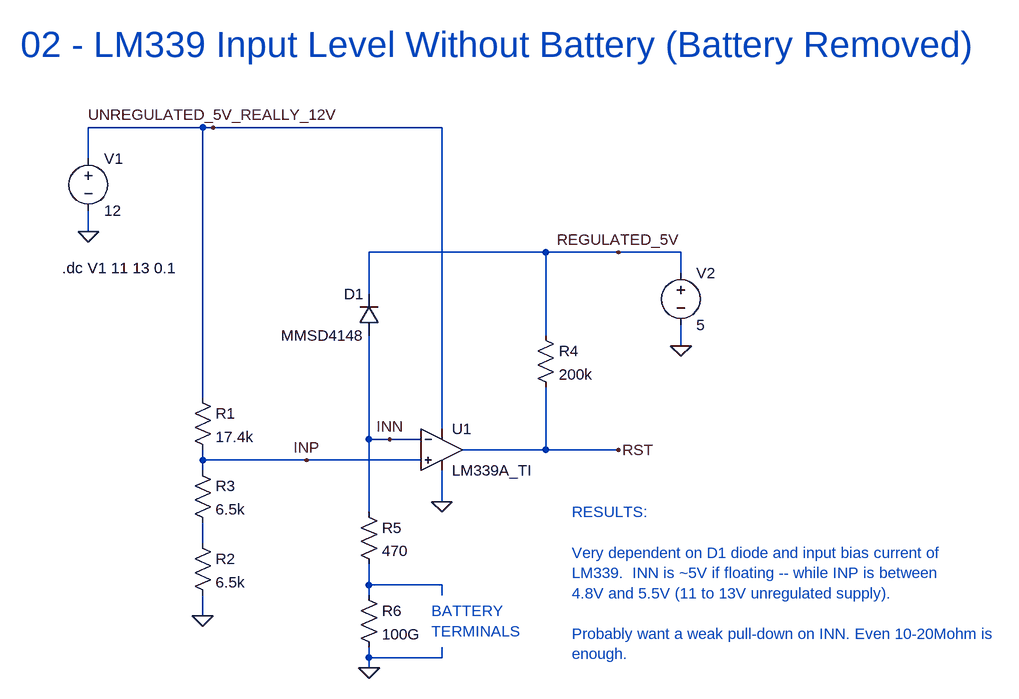
[diagram p0: schematic 02 - LM339 Input Level Without Battery.asc]
02 - LM339 Input Level Without Battery.asc, the LTspice schematic file:
Version 4.1
SHEET 1 1788 744
WIRE 80 -128 -96 -128
WIRE 96 -128 80 -128
WIRE 448 -128 96 -128
WIRE -96 -80 -96 -128
WIRE -96 32 -96 0
WIRE 608 64 336 64
WIRE 720 64 608 64
WIRE 816 64 720 64
WIRE 816 96 816 64
WIRE 336 128 336 64
WIRE 608 192 608 64
WIRE 816 208 816 176
WIRE 80 288 80 -128
WIRE 448 336 448 -128
WIRE 336 352 336 192
WIRE 368 352 336 352
WIRE 416 352 368 352
WIRE 608 368 608 272
WIRE 608 368 480 368
WIRE 720 368 608 368
WIRE 80 384 80 368
WIRE 240 384 80 384
WIRE 416 384 240 384
WIRE 80 400 80 384
WIRE 448 448 448 400
WIRE 336 464 336 352
WIRE 80 512 80 480
WIRE 336 576 336 544
WIRE 448 576 336 576
WIRE 336 592 336 576
WIRE 448 592 448 576
WIRE 80 624 80 592
WIRE 336 688 336 672
WIRE 448 688 448 672
WIRE 448 688 336 688
WIRE 336 704 336 688
FLAG 448 448 0
FLAG 720 368 RST
FLAG 80 624 0
FLAG 368 352 INN
FLAG 336 704 0
FLAG -96 32 0
FLAG 96 -128 UNREGULATED_5V_REALLY_12V
FLAG 816 208 0
FLAG 720 64 REGULATED_5V
FLAG 240 384 INP
SYMBOL ZZZ\\Comparator\\LM339A_TI 448 368 R0
SYMATTR InstName U1
SYMBOL voltage -96 -96 R0
SYMATTR InstName V1
SYMATTR Value 12
SYMBOL res 64 272 R0
SYMATTR InstName R1
SYMATTR Value 17.4k
SYMBOL res 64 496 R0
SYMATTR InstName R2
SYMATTR Value 6.5k
SYMBOL res 592 176 R0
SYMATTR InstName R4
SYMATTR Value 200k
SYMBOL voltage 816 80 R0
SYMATTR InstName V2
SYMATTR Value 5
SYMBOL diode 352 192 R180
WINDOW 0 24 64 Left 2
WINDOW 3 24 0 Left 2
SYMATTR InstName D1
SYMATTR Value MMSD4148
SYMBOL res 320 576 R0
SYMATTR InstName R6
SYMATTR Value 100G
SYMBOL res 64 384 R0
SYMATTR InstName R3
SYMATTR Value 6.5k
SYMBOL res 320 448 R0
SYMATTR InstName R5
SYMATTR Value 470
TEXT -200 -256 Left 5 ;02 - LM339 Input Level Without Battery (Battery Removed)
TEXT 432 616 Left 2 ;BATTERY\nTERMINALS
TEXT -136 88 Left 2 !.dc V1 11 13 0.1
TEXT 648 464 Left 2 ;RESULTS:\n \nVery dependent on D1 diode and input bias current of\nLM339.  INN is ~5V if floating -- while INP is between\n4.8V and 5.5V (11 to 13V unregulated supply).\n \nProbably want a weak pull-down on INN. Even 10-20Mohm is\nenough.

The netlist it stands for:
* 02 - LM339 Input Level Without Battery.asc
* U1: LM339A_TI (symbol ZZZ\Comparator\LM339A_TI not available, pins judged from their places): In+=INP In-=INN V+=UNREGULATED_5V_REALLY_12V V-=0 OUT=RST
V1 UNREGULATED_5V_REALLY_12V 0 12
R1 UNREGULATED_5V_REALLY_12V INP 17.4k
R2 N001 0 6.5k
R4 REGULATED_5V RST 200k
V2 REGULATED_5V 0 5
D1 INN REGULATED_5V MMSD4148
R6 N002 0 100G
R3 INP N001 6.5k
R5 INN N002 470
.model D D
.lib standard.dio
* 02 - LM339 Input Level Without Battery (Battery Removed)
* BATTERY
* TERMINALS
.dc V1 11 13 0.1
* RESULTS:
* Very dependent on D1 diode and input bias current of
* LM339.  INN is ~5V if floating -- while INP is between
* 4.8V and 5.5V (11 to 13V unregulated supply).
* Probably want a weak pull-down on INN. Even 10-20Mohm is
* enough.
.backanno
.end